# Altium schematic sheet 1_P1.schdoc
size 601 x 429 mm; Symbol: Sheet-Symbol_A4; Device: Sheet-Symbol_A4; Company: 嘉立创EDA; Version: V1.0; Page Size: A4; @Project Name: BMCU-V0.6; @Page Count: 1; @Update Date: 2025-03-06; @Create Date: 2024-12-15; @Schematic Name: Schematic1; @Page No: 1; @Page Name: P1; Width: 2338; Height: 1652; Region Start: 1; X Region Count: 6; Y Region Count: 4; Blade Width: 10; Title Block Position: 3; @Board Name: 主机板子; @Create Time: 07:27:10; @Update Time: 19:39:38
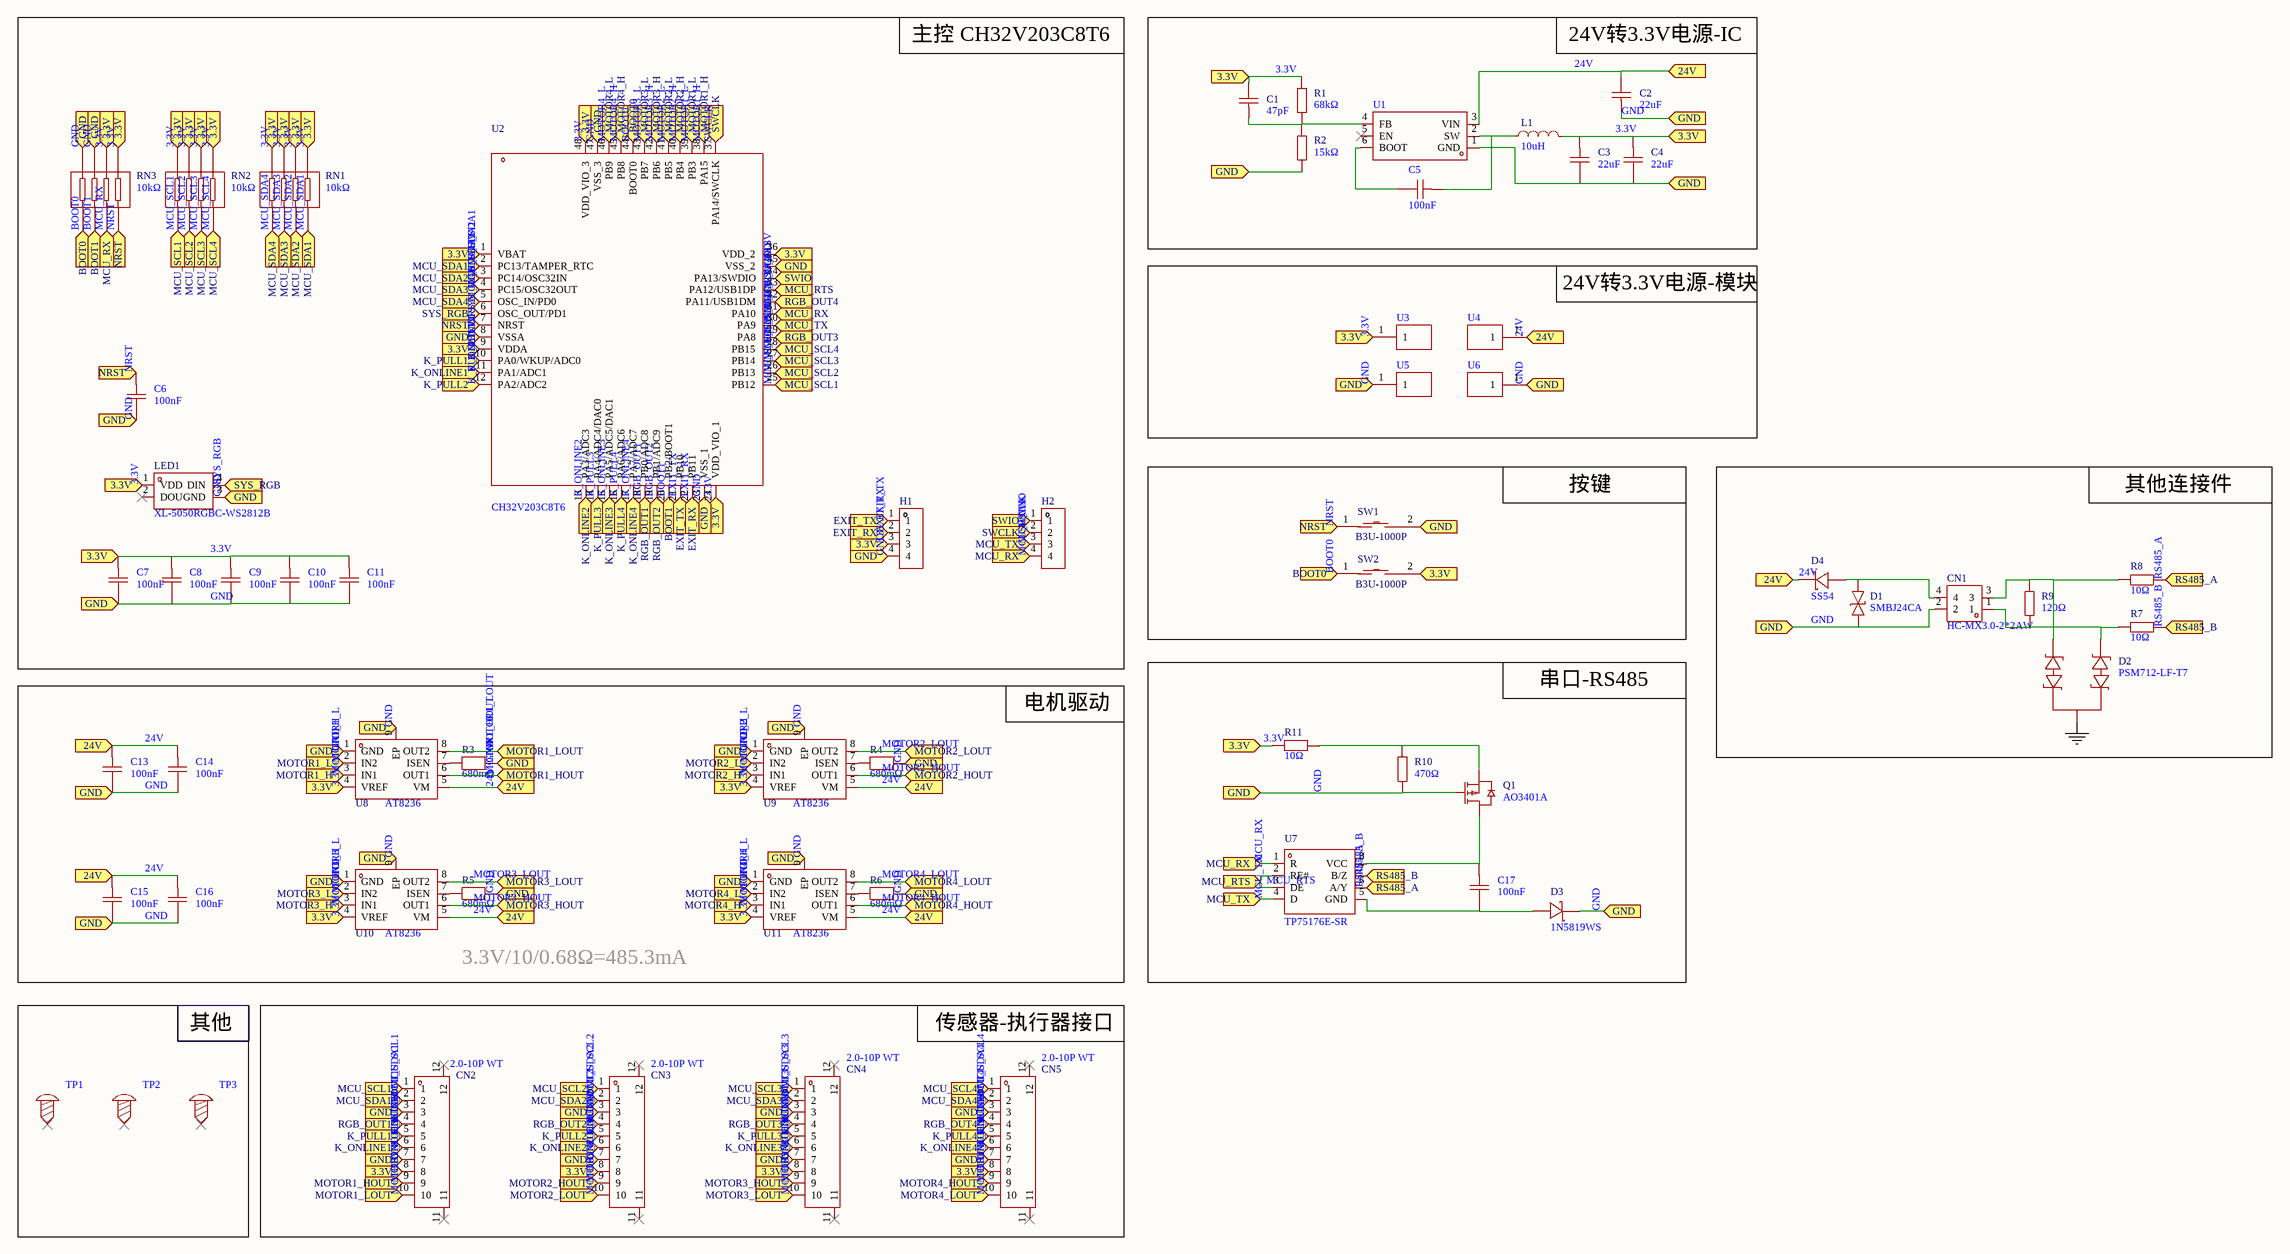
[diagram p0: 1_P1.schdoc]

## Parts
C1  47pF  [C0603]
C2  22uF  [C1206]
C3  22uF  [C0805]
C4  22uF  [C0805]
C5  100nF  [C0603]
C6  100nF  [C0603]
C7  100nF  [C0603]
C8  100nF  [C0603]
C9  100nF  [C0603]
C10  100nF  [C0603]
C11  100nF  [C0603]
C13  100nF  [C0603]
C14  100nF  [C0603]
C15  100nF  [C0603]
C16  100nF  [C0603]
C17  100nF  [C0603]
CN1  HC-MX3.0-2*2AW  [CONN-TH_4P-P3.00_HC-MX3.0-2X2AW_1]
CN2  2.0-10P WT  [CONN-SMD_10P-P2.00_2.0-10P-WT]
CN3  2.0-10P WT  [CONN-SMD_10P-P2.00_2.0-10P-WT]
CN4  2.0-10P WT  [CONN-SMD_10P-P2.00_2.0-10P-WT]
CN5  2.0-10P WT  [CONN-SMD_10P-P2.00_2.0-10P-WT]
D1  SMBJ24CA  [SMB_L4.6-W3.6-LS5.3-BI]
D2  PSM712-LF-T7  [SOT-23-3_L3.0-W1.7-P0.95-LS2.9-BR]
D3  1N5819WS  [SOD-323_L1.8-W1.3-LS2.5-RD]
D4  SS54  [SMA_L4.4-W2.8-LS5.4-R-RD]
H1  (no value)  [HDR-TH_4P-P2.54-V-M]
H2  (no value)  [HDR-TH_4P-P2.54-V-M]
L1  10uH  [IND-SMD_L7.3-W6.8]
LED1  XL-5050RGBC-WS2812B  [LED-SMD_4P-L5.0-W5.0-BL_XL-5050RGBC]
Q1  AO3401A  [SOT-23_L2.9-W1.3-P1.90-LS2.4-BR]
R1  68kΩ  [R0603]
R2  15kΩ  [R0603]
R3  680mΩ  [R1210]
R4  680mΩ  [R1210]
R5  680mΩ  [R1210]
R6  680mΩ  [R1210]
R7  10Ω  [R0603]
R8  10Ω  [R0603]
R9  120Ω  [R0603]
R10  470Ω  [R0603]
R11  10Ω  [R0603]
RN1  10kΩ  [RES-ARRAY-SMD_0603-8P-L3.2-W1.6-BL]
RN2  10kΩ  [RES-ARRAY-SMD_0603-8P-L3.2-W1.6-BL]
RN3  10kΩ  [RES-ARRAY-SMD_0603-8P-L3.2-W1.6-BL]
SW1  B3U-1000P  [KEY-SMD_B3U-1000PM]
SW2  B3U-1000P  [KEY-SMD_B3U-1000PM]
TP1  (no value)  [M2螺丝]
TP2  (no value)  [M2螺丝]
TP3  (no value)  [M2螺丝]
U1  TPS54202DDCR  [SOT-23-6_L2.9-W1.6-P0.95-LS2.8-BL]  (value not drawn)
U2  CH32V203C8T6  [LQFP-48_L7.0-W7.0-P0.50-LS9.0-BL]
U3  (no value)  [SMD 方焊盘 4*5]
U4  (no value)  [SMD 方焊盘 4*5]
U5  (no value)  [SMD 方焊盘 4*5]
U6  (no value)  [SMD 方焊盘 4*5]
U7  TP75176E-SR  [SOP-8_L4.9-W3.9-P1.27-LS6.0-BL]
U8  AT8236  [ESOP-8_L4.9-W3.9-P1.27-LS6.0-BL-EP]
U9  AT8236  [ESOP-8_L4.9-W3.9-P1.27-LS6.0-BL-EP]
U10  AT8236  [ESOP-8_L4.9-W3.9-P1.27-LS6.0-BL-EP]
U11  AT8236  [ESOP-8_L4.9-W3.9-P1.27-LS6.0-BL-EP]

## Blocks framed on the sheet
主控 CH32V203C8T6: C6-C11 H1 H2 LED1 RN1-RN3 U2
24V转3.3V电源-IC: C1-C5 L1 R1 R2 U1
24V转3.3V电源-模块: U3-U6
按键: SW1 SW2
其他连接件: CN1 D1 D2 D4 R7-R9
串口-RS485: C17 D3 Q1 R10 R11 U7
其他: TP1-TP3
传感器-执行器接口: CN2-CN5

## Ports
3.3V (in), 24V (in), BOOT0 (in), BOOT1 (in), EXIT_RX (in), EXIT_TX (in), GND (in), K_ONLINE1 (in), K_ONLINE2 (in), K_ONLINE3 (in), K_ONLINE4 (in), K_PULL1 (in), K_PULL2 (in), K_PULL3 (in), K_PULL4 (in), MCU_RTS (in), MCU_RX (in), MCU_SCL1 (in), MCU_SCL2 (in), MCU_SCL3 (in), MCU_SCL4 (in), MCU_SDA1 (in), MCU_SDA2 (in), MCU_SDA3 (in), MCU_SDA4 (in), MCU_TX (in), MOTOR1_H (in), MOTOR1_HOUT (in), MOTOR1_L (in), MOTOR1_LOUT (in), MOTOR2_H (in), MOTOR2_HOUT (in), MOTOR2_L (in), MOTOR2_LOUT (in), MOTOR3_H (in), MOTOR3_HOUT (in), MOTOR3_L (in), MOTOR3_LOUT (in), MOTOR4_H (in), MOTOR4_HOUT (in), MOTOR4_L (in), MOTOR4_LOUT (in), NRST (in), RGB_OUT1 (in), RGB_OUT2 (in), RGB_OUT3 (in), RGB_OUT4 (in), RS485_A (in), RS485_B (in), SWCLK (in), SWIO (in), SYS_RGB (in)

## Nets
GND: C2.1 C3.1 C4.1 C6.1 C7.1 C8.1 C9.1 C10.1 C11.1 C13.1 C14.1 C15.1 C16.1 CN1.2 CN2.3 CN2.7 CN3.3 CN3.7 CN4.3 CN4.7 CN5.3 CN5.7 D1.1 D2.3(K) D3.1(K) H1.4 LED1.3(GND) Q1.1(G) R2.1 R3.2 R4.2 R5.2 R6.2 R10.1 RN3.7 RN3.8 SW1.2 U1.1(GND) U2.8(VSSA) U2.23(VSS_1) U2.35(VSS_2) U2.47(VSS_3) U5.1 U6.1 U8.1(GND) U8.9(EP) U9.1(GND) U9.9(EP) U10.1(GND) U10.9(EP) U11.1(GND) U11.9(EP) ; port GND
3.3V: C1.2 C3.2 C4.2 C7.2 C8.2 C9.2 C10.2 C11.2 CN2.8 CN3.8 CN4.8 CN5.8 H1.3 L1.2 LED1.1(VDD) R1.2 R11.1 RN1.5 RN1.6 RN1.7 RN1.8 RN2.5 RN2.6 RN2.7 RN2.8 RN3.5 RN3.6 SW2.2 U2.1(VBAT) U2.9(VDDA) U2.24(VDD_VIO_1) U2.36(VDD_2) U2.48(VDD_VIO_3) U3.1 U8.4(VREF) U9.4(VREF) U10.4(VREF) U11.4(VREF) ; port 3.3V
24V: C2.2 C13.2 C14.2 C15.2 C16.2 D4.2(K) U1.3(VIN) U4.1 U8.5(VM) U9.5(VM) U10.5(VM) U11.5(VM) ; port 24V
BOOT0: RN3.1 SW2.1 U2.44(BOOT0) ; port BOOT0
BOOT1: RN3.2 U2.20(PB2/BOOT1) ; port BOOT1
EXIT_RX: H1.2 U2.22(PB11) ; port EXIT_RX
EXIT_TX: H1.1 U2.21(PB10) ; port EXIT_TX
K_ONLINE1: CN2.6 U2.11(PA1/ADC1) ; port K_ONLINE1
K_ONLINE2: CN3.6 U2.13(PA3/ADC3) ; port K_ONLINE2
K_ONLINE3: CN4.6 U2.15(PA5/ADC5/DAC1) ; port K_ONLINE3
K_ONLINE4: CN5.6 U2.17(PA7/ADC7) ; port K_ONLINE4
K_PULL1: CN2.5 U2.10(PA0/WKUP/ADC0) ; port K_PULL1
K_PULL2: CN3.5 U2.12(PA2/ADC2) ; port K_PULL2
K_PULL3: CN4.5 U2.14(PA4/ADC4/DAC0) ; port K_PULL3
K_PULL4: CN5.5 U2.16(PA6/ADC6) ; port K_PULL4
MCU_RTS: U2.33(PA12/USB1DP) U7.2(RE#) U7.3(DE) ; port MCU_RTS
MCU_RX: H2.4 RN3.3 U2.31(PA10) U7.1(R) ; port MCU_RX
MCU_SCL1: CN2.1 RN2.1 U2.25(PB12) ; port MCU_SCL1
MCU_SCL2: CN3.1 RN2.2 U2.26(PB13) ; port MCU_SCL2
MCU_SCL3: CN4.1 RN2.3 U2.27(PB14) ; port MCU_SCL3
MCU_SCL4: CN5.1 RN2.4 U2.28(PB15) ; port MCU_SCL4
MCU_SDA1: CN2.2 RN1.4 U2.2(PC13/TAMPER_RTC) ; port MCU_SDA1
MCU_SDA2: CN3.2 RN1.3 U2.3(PC14/OSC32IN) ; port MCU_SDA2
MCU_SDA3: CN4.2 RN1.2 U2.4(PC15/OSC32OUT) ; port MCU_SDA3
MCU_SDA4: CN5.2 RN1.1 U2.5(OSC_IN/PD0) ; port MCU_SDA4
MCU_TX: H2.3 U2.30(PA9) U7.4(D) ; port MCU_TX
MOTOR1_H: U2.38(PA15) U8.3(IN1) ; port MOTOR1_H
MOTOR1_HOUT: CN2.9 U8.6(OUT1) ; port MOTOR1_HOUT
MOTOR1_L: U2.39(PB3) U8.2(IN2) ; port MOTOR1_L
MOTOR1_LOUT: CN2.10 U8.8(OUT2) ; port MOTOR1_LOUT
MOTOR2_H: U2.40(PB4) U9.3(IN1) ; port MOTOR2_H
MOTOR2_HOUT: CN3.9 U9.6(OUT1) ; port MOTOR2_HOUT
MOTOR2_L: U2.41(PB5) U9.2(IN2) ; port MOTOR2_L
MOTOR2_LOUT: CN3.10 U9.8(OUT2) ; port MOTOR2_LOUT
MOTOR3_H: U2.42(PB6) U10.3(IN1) ; port MOTOR3_H
MOTOR3_HOUT: CN4.9 U10.6(OUT1) ; port MOTOR3_HOUT
MOTOR3_L: U2.43(PB7) U10.2(IN2) ; port MOTOR3_L
MOTOR3_LOUT: CN4.10 U10.8(OUT2) ; port MOTOR3_LOUT
MOTOR4_H: U2.45(PB8) U11.3(IN1) ; port MOTOR4_H
MOTOR4_HOUT: CN5.9 U11.6(OUT1) ; port MOTOR4_HOUT
MOTOR4_L: U2.46(PB9) U11.2(IN2) ; port MOTOR4_L
MOTOR4_LOUT: CN5.10 U11.8(OUT2) ; port MOTOR4_LOUT
NRST: C6.2 RN3.4 SW1.1 U2.7(NRST) ; port NRST
RGB_OUT1: CN2.4 U2.18(PB0/ADC8) ; port RGB_OUT1
RGB_OUT2: CN3.4 U2.19(PB1/ADC9) ; port RGB_OUT2
RGB_OUT3: CN4.4 U2.29(PA8) ; port RGB_OUT3
RGB_OUT4: CN5.4 U2.32(PA11/USB1DM) ; port RGB_OUT4
RS485_A: R8.1 U7.6(A/Y) ; port RS485_A
RS485_B: R7.1 U7.7(B/Z) ; port RS485_B
SWCLK: H2.2 U2.37(PA14/SWCLK) ; port SWCLK
SWIO: H2.1 U2.34(PA13/SWDIO) ; port SWIO
SYS_RGB: LED1.4(DIN) U2.6(OSC_OUT/PD1) ; port SYS_RGB
NetC1_1: C1.1 R1.1 R2.2 U1.4(FB)
NetC5_1: C5.1 U1.6(BOOT)
NetC5_2: C5.2 L1.1 U1.2(SW)
NetC17_1: C17.1 D3.2(A) U7.5(GND)
NetC17_2: C17.2 Q1.3(D) U7.8(VCC)
NetCN1_1: CN1.1 D2.1(A1) R7.2 R9.2
NetCN1_3: CN1.3 D2.2(A1) R8.2 R9.1
NetCN1_4: CN1.4 D1.2 D4.1(A)
NetQ1_2: Q1.2(S) R10.2 R11.2
NetR3_1: R3.1 U8.7(ISEN)
NetR4_1: R4.1 U9.7(ISEN)
NetR5_1: R5.1 U10.7(ISEN)
NetR6_1: R6.1 U11.7(ISEN)

Not connected (* = marked no-connect by the designer): CN2 11* 12*; CN3 11* 12*; CN4 11* 12*; CN5 11* 12*; LED1 2(DOU)*; TP1 1*; TP2 1*; TP3 1*; U1 5(EN)*

## Notes on the sheet
- 电机驱动
- 3.3V/10/0.68Ω=485.3mA
- Schematic1
- 2025-03-06
- P1
- 2024-12-15
- BMCU-V0.6
- V1.0
- A4
- 1
- 嘉立创EDA

## Library data of the parts
C1 = CL10C470JB8NNNC: Manufacturer: SAMSUNG(三星); Add into BOM: yes; Tolerance: ±5%; Voltage Rated: 50V; Temperature Coefficient: C0G; Symbol: CL10C470JB8NNNC; Device: CL10C470JB8NNNC; LCSC Part Name: 47pF ±5% 50V; Supplier Part: C1671; Manufacturer Part: CL10C470JB8NNNC; Supplier Footprint: 0603; JLCPCB Part Class: 基础库; Datasheet: https://atta.szlcsc.com/upload/public/pdf/source/20160218/1457707763339.pdf; Supplier: LCSC; Convert to PCB: yes; Value: 47pF
C2 = CL31A226KAHNNNE: Manufacturer: SAMSUNG(三星); Add into BOM: yes; Tolerance: ±10%; Voltage Rated: 25V; Temperature Coefficient: X5R; Symbol: CL31A226KAHNNNE; Device: CL31A226KAHNNNE; LCSC Part Name: 22uF ±10% 25V; Supplier Part: C12891; Manufacturer Part: CL31A226KAHNNNE; Supplier Footprint: 1206; JLCPCB Part Class: 基础库; Datasheet: https://atta.szlcsc.com/upload/public/pdf/source/20160218/1457707763339.pdf; Supplier: LCSC; Convert to PCB: yes; Value: 22uF
C3 C4 = CL21A226MAQNNNE: Manufacturer: SAMSUNG(三星); Add into BOM: yes; Tolerance: ±20%; Voltage Rated: 25V; Temperature Coefficient: X5R; Symbol: CL21A226MAQNNNE; Device: CL21A226MAQNNNE; LCSC Part Name: 22uF ±20% 25V; Supplier Part: C45783; Manufacturer Part: CL21A226MAQNNNE; Supplier Footprint: 0805; JLCPCB Part Class: 基础库; Datasheet: https://atta.szlcsc.com/upload/public/pdf/source/20160218/1457707763339.pdf; Supplier: LCSC; Convert to PCB: yes; Value: 22uF
C5-C11 C13-C17 = CC0603KRX7R9BB104: Manufacturer: YAGEO(国巨); Symbol: CapAcitance; Add into BOM: yes; Tolerance: ±10%; Voltage Rated: 50V; Temperature Coefficient: X7R; Device: CC0603KRX7R9BB104; LCSC Part Name: 100nF ±10% 50V; Supplier Part: C14663; Manufacturer Part: CC0603KRX7R9BB104; Supplier Footprint: 0603; JLCPCB Part Class: Basic Part; Datasheet: https://atta.szlcsc.com/upload/public/pdf/source/20180910/C282072_33301C7F631E79921B82A8DAC6BCC5B3.pdf; Supplier: LCSC; Convert to PCB: yes; Value: 100nF
CN1 = HC-MX3.0-2*2AW: Manufacturer: HCTL(华灿天禄); Add into BOM: yes; Pins Structure: 2x2P; Pitch: 3mm; Number of PINs Per Row: 2; Current Rating (Max): 5A; Reference Series: Micro-Fit(MX 3.0); Rated Voltage (Max): 250V; Plastic Material: PA66; Supplementary Features: 鱼叉脚(塑料); Symbol: HC-MX3.0-2*2AW; Device: HC-MX3.0-2*2AW; LCSC Part Name: 2x2P 间距:3mm 弯插 系列:Micro-Fit(MX 3.0); Supplier Part: C3294383; Manufacturer Part: HC-MX3.0-2*2AW; Supplier Footprint: 弯插,P=3mm; JLCPCB Part Class: Extended Part; Datasheet: https://atta.szlcsc.com/upload/public/pdf/source/20240325/6515A412CF75DC76B766B405583CF347.pdf; Supplier: LCSC; Convert to PCB: yes; Mounting Style: 弯插; Number of Pins: 4P; Number of Rows: 2; Row Spacing: 3mm; Contact Material: 黄铜; Contact Plating: 锡; Operating Temperature Range: -25℃~+85℃; Flame Retardant Rating: -; Colour: 黑色; Z-Height of the Board: -; X-Length of Bottom Edge on Board (Spacing Line): -; Y-Width of Bottom Edge on Board: -
CN2-CN5 = 2.0-10P WT: Manufacturer: SHOU HAN(首韩); Add into BOM: yes; Pins Structure: 1x10P; Pitch: 2mm; Reference Series: PH; Number of PINs Per Row: 10; Current Rating (Max): 2A; Symbol: 2.0-10P WT; Device: 2.0-10P WT; LCSC Part Name: 间距:2mm 1x10P 卧贴; Supplier Part: C5340818; Manufacturer Part: 2.0-10P WT; Supplier Footprint: SMD,P=2mm,卧贴; Datasheet: https://atta.szlcsc.com/upload/public/pdf/source/20221228/2B469FB976A3BE7FA48F92FFEBDB46D7.pdf; Supplier: LCSC; Convert to PCB: yes; Mounting Style: 卧贴; Number of Pins: 10P; Number of Rows: 1; Operating Temperature Range: -25℃~+85℃
D1 = SMBJ24CA_C693497: Manufacturer: FTR(乔光电子); Add into BOM: yes; polarity: 双向; Reverse Stand-Off Voltage (Vrwm): 24V; Maximum Clamping Voltage: 38.9V; Peak Pulse Current (Ipp)@10/1000us: 15.5A; Type: TVS; Symbol: SMBJ24CA_C693497; Device: SMBJ24CA_C693497; Supplier: LCSC; Supplier Part: C693497; Manufacturer Part: SMBJ24CA; JLCPCB Part Class: 扩展库; LCSC Part Name: SMBJ24CA; Supplier Footprint: SMB(DO-214AA); Datasheet: https://atta.szlcsc.com/upload/public/pdf/source/20200701/C693490_2A1922FF33BB98835C22E740F3EF18EC.pdf; Convert to PCB: yes; Breakdown Voltage: 38.9V
D2 = PSM712-LF-T7: Manufacturer: PROTEK; Add into BOM: yes; Reverse Stand-Off Voltage (Vrwm): 12V; Maximum Clamping Voltage: 19V; Breakdown Voltage: 13.3V; Type: TVS; Symbol: PSM712-LF-T7; Device: PSM712-LF-T7; LCSC Part Name: PSM712-LF-T7; Supplier Part: C32677; Manufacturer Part: PSM712-LF-T7; Supplier Footprint: SOT-23; JLCPCB Part Class: 基础库; Datasheet: https://atta.szlcsc.com/upload/public/pdf/source/20140717/1457707154667.pdf; Supplier: LCSC; Convert to PCB: yes
D3 = 1N5819WS_C191023: Manufacturer: Hottech(合科泰); Add into BOM: yes; Forward Voltage (Vf@If): 600mV@1A; Reverse Voltage (Vr): 40V; Rectified Current: 1A; Symbol: 1N5819WS; Device: 1N5819WS_C191023; LCSC Part Name: 电压:40V 电流:1A; Supplier Part: C191023; Manufacturer Part: 1N5819WS; Supplier Footprint: SOD-323; Datasheet: https://atta.szlcsc.com/upload/public/pdf/source/20220428/3CB86FD8D28D653594B4E35F9D5AEFD9.pdf; Supplier: LCSC; Convert to PCB: yes
D4 = SS54_C22452: Manufacturer: MDD(辰达半导体); Add into BOM: yes; Diode Configuration: 独立式; Forward Voltage (Vf@If): 550mV@5A; Reverse Voltage (Vr): 40V; Rectified Current: 5A; Reverse Leakage Current (Ir): 1mA@40V; Symbol: SS54_C22452; Device: SS54_C22452; LCSC Part Name: 电压:40V 电流:5A; Supplier Part: C22452; Manufacturer Part: SS54; Supplier Footprint: SMA(DO-214AC); Datasheet: https://atta.szlcsc.com/upload/public/pdf/source/20240710/73DFBB65C1883B895E62D589679033DF.pdf; Supplier: LCSC; Convert to PCB: yes
H1 H2 = HDR-M_2.54_1x4P: Symbol: PZ254V-11-04P; Convert to PCB: yes; Device: HDR-M_2.54_1x4P; Add into BOM: yes; Supplier Part: C492403; Supplier Footprint: 插件
L1 = FXL0630-100-M: Manufacturer: cjiang(长江微电); Add into BOM: yes; Tolerance: ±20%; Rated Current: 4.5A; Saturation Current (Isat): 5.5A; DC Resistance (DCR): 68mΩ; Type: 一体成型电感; Symbol: FXL0630-100-M; Device: FXL0630-100-M; LCSC Part Name: 10uH ±20% 5.5A; Supplier Part: C167223; Manufacturer Part: FXL0630-100-M; Supplier Footprint: SMD,6.6x7mm; JLCPCB Part Class: 扩展库; Datasheet: https://atta.szlcsc.com/upload/public/pdf/source/20230516/3A080F5AF8C87BB81C3BA86E5F60E51A.pdf; Supplier: LCSC; Convert to PCB: yes; Value: 10uH; Ratings: -
LED1 = XL-5050RGBC-WS2812B: Manufacturer: XINGLIGHT(成兴光); Add into BOM: yes; Symbol: XL-5050RGBC-WS2812B; Device: XL-5050RGBC-WS2812B; LCSC Part Name: XL-5050RGBC-WS2812B; Supplier Part: C2843785; Manufacturer Part: XL-5050RGBC-WS2812B; Supplier Footprint: SMD5050; Datasheet: https://atta.szlcsc.com/upload/public/pdf/source/20240412/E1004CAA80592E31D08BFE019083806F.pdf; Supplier: LCSC; Convert to PCB: yes
Q1 = AO3401A_C347476: Manufacturer: UMW(友台半导体); Add into BOM: yes; Type: 1个P沟道; Drain Source Voltage (Vdss): 30V; Continuous Drain Current (Id): 4.2A; Drain Source On Resistance (RDS(on)@Vgs,Id): 50mΩ@10V; Power Dissipation (Pd): 1.4W; Gate Threshold Voltage (Vgs(th)@Id): 400mV@250uA; Total Gate Charge (Qg@Vgs): 9.4nC@4.5V; Input Capacitance (Ciss@Vds): 954pF; Reverse Transfer Capacitance (Crss@Vds): 77pF; Symbol: AO3401A_C347476; Device: AO3401A_C347476; LCSC Part Name: 1个P沟道 耐压:30V 电流:4.2A; Supplier Part: C347476; Manufacturer Part: AO3401A; Supplier Footprint: SOT-23; JLCPCB Part Class: 扩展库; Datasheet: https://atta.szlcsc.com/upload/public/pdf/source/20231109/42F312EBB081D72F04A7E8221BFFAF9D.pdf; Supplier: LCSC; Convert to PCB: yes; Operating Temperature: -55℃~+150℃
R1 = 0603WAF6802T5E: Manufacturer: UNI-ROYAL(厚声); Add into BOM: yes; Tolerance: ±1%; Power(Watts): 100mW; Overload Voltage (Max): 75V; Temperature Coefficient: ±100ppm/℃; Symbol: 0603WAF6802T5E; Device: 0603WAF6802T5E; Supplier: LCSC; Manufacturer Part: 0603WAF6802T5E; Supplier Part: C23231; Value: 68kΩ; LCSC Part Name: 68kΩ ±1% 100mW 厚膜电阻; Supplier Footprint: 0603; Datasheet: https://atta.szlcsc.com/upload/public/pdf/source/20200306/C422600_1E6D84923E4A46A82E41ADD87F860B5C.pdf; Convert to PCB: yes; Type: 厚膜电阻; Operating Temperature Range: -55℃~+155℃
R2 = 0603WAF1502T5E: Manufacturer: UNI-ROYAL(厚声); Add into BOM: yes; Tolerance: ±1%; Power(Watts): 100mW; Temperature Coefficient: ±100ppm/℃; Overload Voltage (Max): 75V; Symbol: 0603WAF1502T5E; Device: 0603WAF1502T5E; LCSC Part Name: 15kΩ ±1% 100mW; Supplier Part: C22809; Manufacturer Part: 0603WAF1502T5E; Supplier Footprint: 0603; JLCPCB Part Class: Basic Part; Datasheet: https://atta.szlcsc.com/upload/public/pdf/source/20200306/C422600_1E6D84923E4A46A82E41ADD87F860B5C.pdf; Supplier: LCSC; Convert to PCB: yes; Type: 厚膜电阻; Value: 15kΩ; Operating Temperature Range: -55℃~+155℃
R3-R6 = 1210W2F680LT5E: Manufacturer: UNI-ROYAL(厚声); Add into BOM: yes; Tolerance: ±1%; Power(Watts): 500mW; Overload Voltage (Max): 200V; Symbol: 1210W2F680LT5E; Device: 1210W2F680LT5E; LCSC Part Name: 680mΩ ±1% 500mW 厚膜电阻; Supplier Part: C620653; Manufacturer Part: 1210W2F680LT5E; Supplier Footprint: 1210; Datasheet: https://atta.szlcsc.com/upload/public/pdf/source/20200306/C422600_1E6D84923E4A46A82E41ADD87F860B5C.pdf; Supplier: LCSC; Convert to PCB: yes; Type: 厚膜电阻; Value: 680mΩ; Operating Temperature Range: -55℃~+155℃
R7 R8 R11 = 0603WAF100JT5E: Manufacturer: UNI-ROYAL(厚声); Add into BOM: yes; Tolerance: ±1%; Power(Watts): 100mW; Overload Voltage (Max): 75V; Temperature Coefficient: ±400ppm/℃; Symbol: 0603WAF100JT5E; Device: 0603WAF100JT5E; LCSC Part Name: 10Ω ±1% 100mW 厚膜电阻; Supplier Part: C22859; Manufacturer Part: 0603WAF100JT5E; Supplier Footprint: 0603; JLCPCB Part Class: 基础库; Datasheet: https://atta.szlcsc.com/upload/public/pdf/source/20200306/C422600_1E6D84923E4A46A82E41ADD87F860B5C.pdf; Supplier: LCSC; Convert to PCB: yes; Type: 厚膜电阻; Value: 10Ω; Operating Temperature Range: -55℃~+155℃
R9 = 0603WAF1200T5E: Manufacturer: UNI-ROYAL(厚声); Add into BOM: yes; Tolerance: ±1%; Power(Watts): 100mW; Overload Voltage (Max): 75V; Temperature Coefficient: ±100ppm/℃; Symbol: 0603WAF1200T5E; Device: 0603WAF1200T5E; LCSC Part Name: 120Ω ±1% 100mW 厚膜电阻; Supplier Part: C22787; Manufacturer Part: 0603WAF1200T5E; Supplier Footprint: 0603; Datasheet: https://atta.szlcsc.com/upload/public/pdf/source/20200306/C422600_1E6D84923E4A46A82E41ADD87F860B5C.pdf; Supplier: LCSC; Convert to PCB: yes; Type: 厚膜电阻; Value: 120Ω; Operating Temperature Range: -55℃~+155℃
R10 = 0603WAF4700T5E: Manufacturer: UNI-ROYAL(厚声); Add into BOM: yes; Tolerance: ±1%; Power(Watts): 100mW; Overload Voltage (Max): 75V; Temperature Coefficient: ±100ppm/℃; Symbol: 0603WAF4700T5E; Device: 0603WAF4700T5E; LCSC Part Name: 470Ω ±1% 100mW 厚膜电阻; Supplier Part: C23179; Manufacturer Part: 0603WAF4700T5E; Supplier Footprint: 0603; Datasheet: https://atta.szlcsc.com/upload/public/pdf/source/20200306/C422600_1E6D84923E4A46A82E41ADD87F860B5C.pdf; Supplier: LCSC; Convert to PCB: yes; Type: 厚膜电阻; Value: 470Ω; Operating Temperature Range: -55℃~+155℃
RN1-RN3 = 4D03WGJ0103T5E: Manufacturer: UNI-ROYAL(厚声); Add into BOM: yes; Number of Resistors: 4; Tolerance: ±5%; Power(Watts): 62.5mW; Temperature Coefficient: ±200ppm/℃; Symbol: 4D03WGJ0103T5E; Device: 4D03WGJ0103T5E; LCSC Part Name: 10kΩ ±5%; Supplier Part: C29718; Manufacturer Part: 4D03WGJ0103T5E; Supplier Footprint: 0603x4; JLCPCB Part Class: 基础库; Datasheet: https://atta.szlcsc.com/upload/public/pdf/source/20191224/C474318_2527498AE30E813171187CCD28401A71.pdf; Supplier: LCSC; Convert to PCB: yes; Value: 10kΩ; Number of Pins: 8
SW1 SW2 = B3U-1000P: Manufacturer: OMRON(欧姆龙); Add into BOM: yes; Contact Current: 50mA; Voltage Rating (DC): 12V; Circuit: 单刀单掷; Actuator Style: 圆形按钮; Switch Length: 3mm; Switch Width: 2.5mm; Switch Height: 1.6mm; Symbol: B3U-1000P; Device: B3U-1000P; LCSC Part Name: B3U-1000P; Supplier Part: C231329; Manufacturer Part: B3U-1000P; Supplier Footprint: SMD,3x2.5mm; JLCPCB Part Class: Extended Part; Datasheet: https://atta.szlcsc.com/upload/public/pdf/source/20180629/C231329_070179C33643744C5978F4F02109B85D.pdf; Supplier: LCSC; Convert to PCB: yes; Mounting Style: 立贴; With Lamp: -
TP1-TP3 = M2螺丝: Symbol: 螺丝孔; Convert to PCB: yes; Device: M2螺丝; Add into BOM: yes; Supplier Footprint: 插件
U1 = TPS54202DDCR: Manufacturer: TI(德州仪器); Add into BOM: yes; Symbol: TPS54202DDCR; Device: TPS54202DDCR; LCSC Part Name: TPS54202DDCR; Supplier Part: C191884; Manufacturer Part: TPS54202DDCR; Supplier Footprint: SOT-23-6; JLCPCB Part Class: Extended Part; Datasheet: https://atta.szlcsc.com/upload/public/pdf/source/20181012/C191884_C6DBFD980275651BD8C8F427C2E48058.pdf; Supplier: LCSC; Convert to PCB: yes
U2 = CH32V203C8T6: Manufacturer: WCH(南京沁恒); Add into BOM: yes; CPU Core: RISC-V; Program Storage Size: 64KB; RAM Size: 20KB; CPU Maximum Speed: 144MHz; Program Memory Type: FLASH; Symbol: CH32V203C8T6; Device: CH32V203C8T6; LCSC Part Name: CH32V203C8T6; Supplier Part: C3001172; Manufacturer Part: CH32V203C8T6; Supplier Footprint: LQFP-48(7x7); Datasheet: https://atta.szlcsc.com/upload/public/pdf/source/20220425/D3E728E801B9982E2758AC225E3A30F9.pdf; Supplier: LCSC; Convert to PCB: yes; GPIO Ports Number: -; Operating Voltage Range: -; Operating Temperature Range: -; ADC (Bit): -; DAC (Bit): -; PWM (Bit): -; 8Bit Timer: -; 16Bit Timer: -; 32Bit Timer: -; CAN: -; UART/USART: -; I2C: -; I2S: -; SPI: -; Universal Serial Bus: -; Internal Comparator: -; Peripheral/Function: -; communication protocol: -; Watchdog: -; Real-Time Clock: -; Infrared Data Association: -; Low-Voltage Detect: -; CCP Capture/Compare: -; Secure Digital Input and Output: -; Direct Memory Access: -; Internal Oscillator: -
U3-U6 = 方焊盘 4*5: Add into BOM: yes; Check: false; Symbol: 方焊盘 4*5; Device: 方焊盘 4*5; Convert to PCB: yes
U7 = TP75176E-SR: Manufacturer: 3PEAK; Add into BOM: yes; Types: 收发器; Supply Voltage: 3V~5.5V; Data Rate: 10Mbps; Driver/receiver: 1/1; Symbol: TP75176E-SR; Device: TP75176E-SR; LCSC Part Name: 3V~5.5V供电 10Mbps 收发器; Supplier Part: C94207; Manufacturer Part: TP75176E-SR; Supplier Footprint: SOP-8; JLCPCB Part Class: 扩展库; Datasheet: https://atta.szlcsc.com/upload/public/pdf/source/20170228/1488267657599.pdf; Supplier: LCSC; Convert to PCB: yes
U8-U11 = AT8236: Manufacturer: 杭州中科微; Add into BOM: yes; Symbol: AT8236; Device: AT8236; LCSC Part Name: AT8236; Supplier Part: C2827823; Manufacturer Part: AT8236; Supplier Footprint: ESOP-8; Datasheet: https://atta.szlcsc.com/upload/public/pdf/source/20210923/1552D95CBAF8BE780D06AE79E7783380.pdf; Supplier: LCSC; Convert to PCB: yes